# EAGLE board BMS_Master (EAGLE 6.6.0)
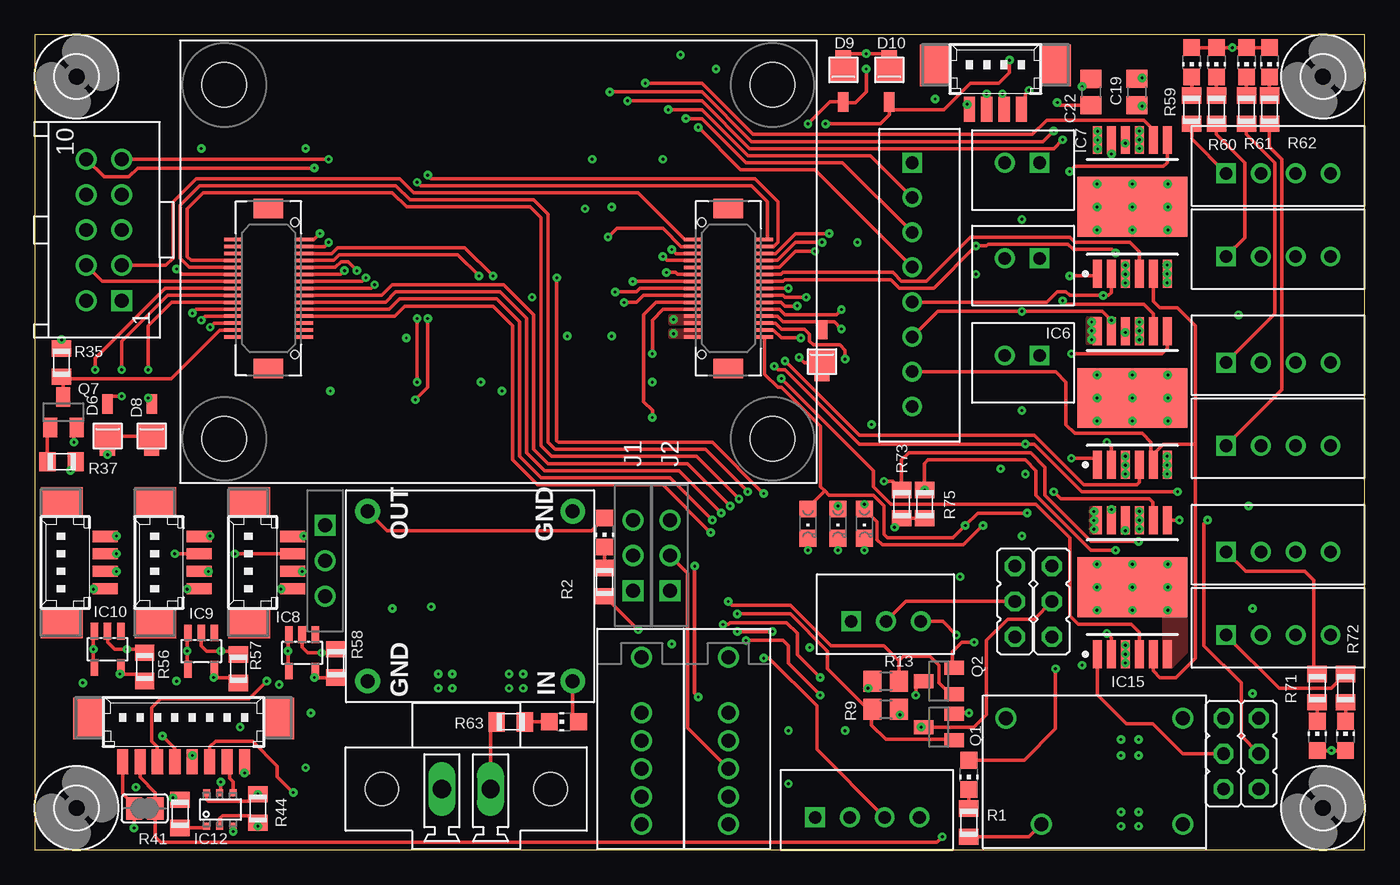
[diagram p7: board, top side]
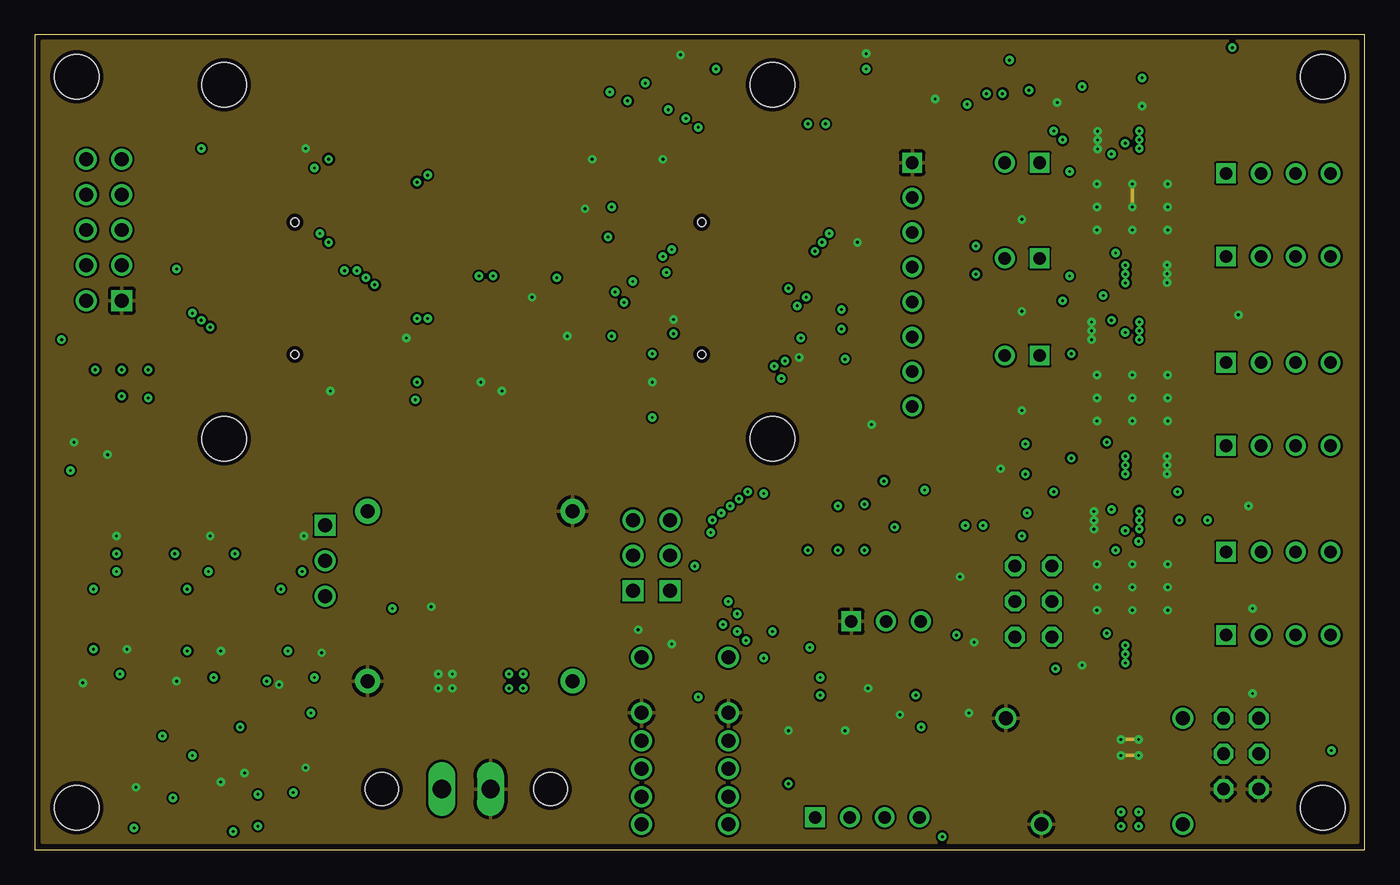
[diagram p8: board, inner layer Route2]
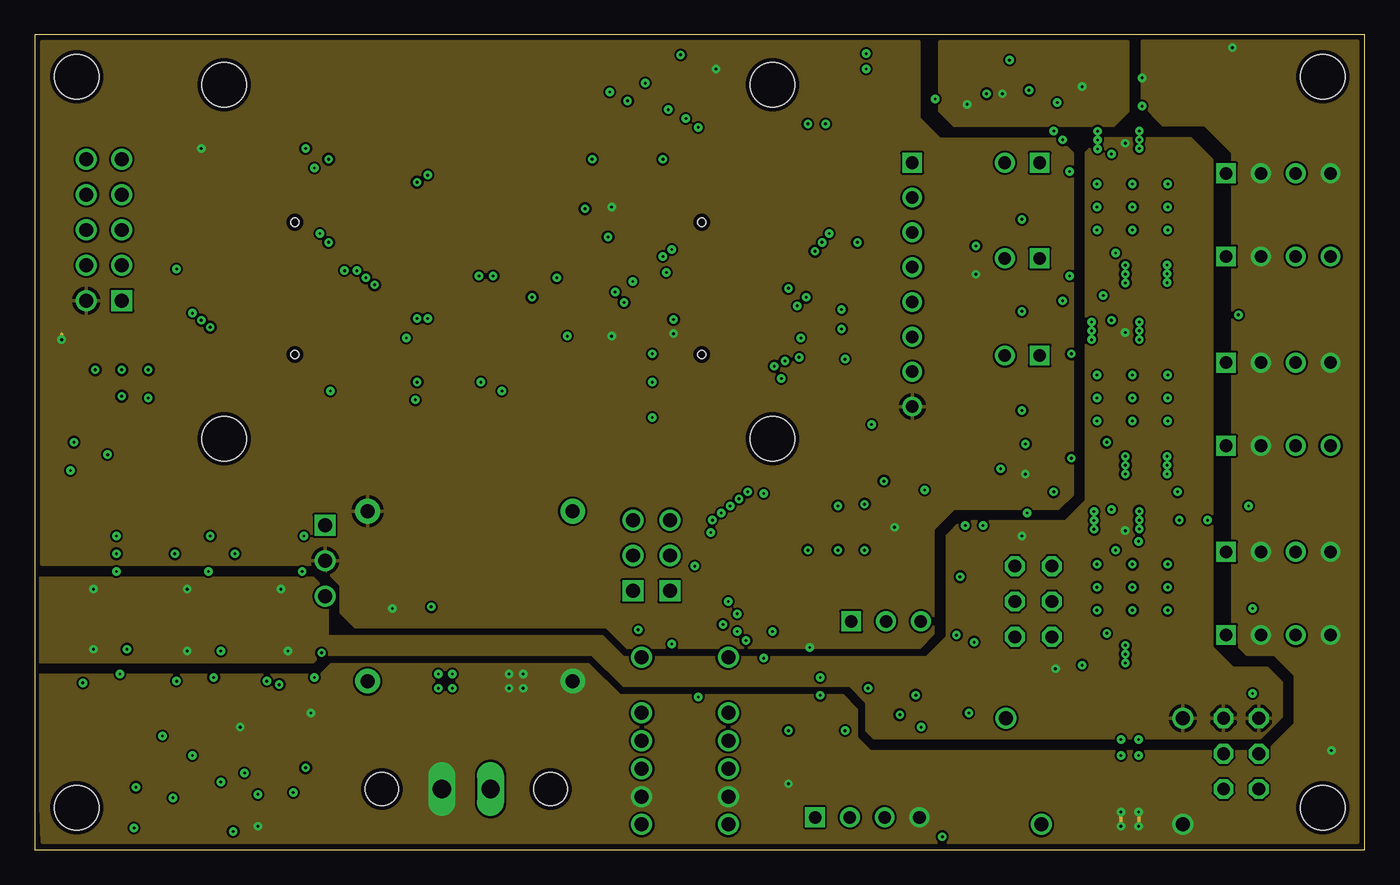
[diagram p9: board, inner layer Route15]
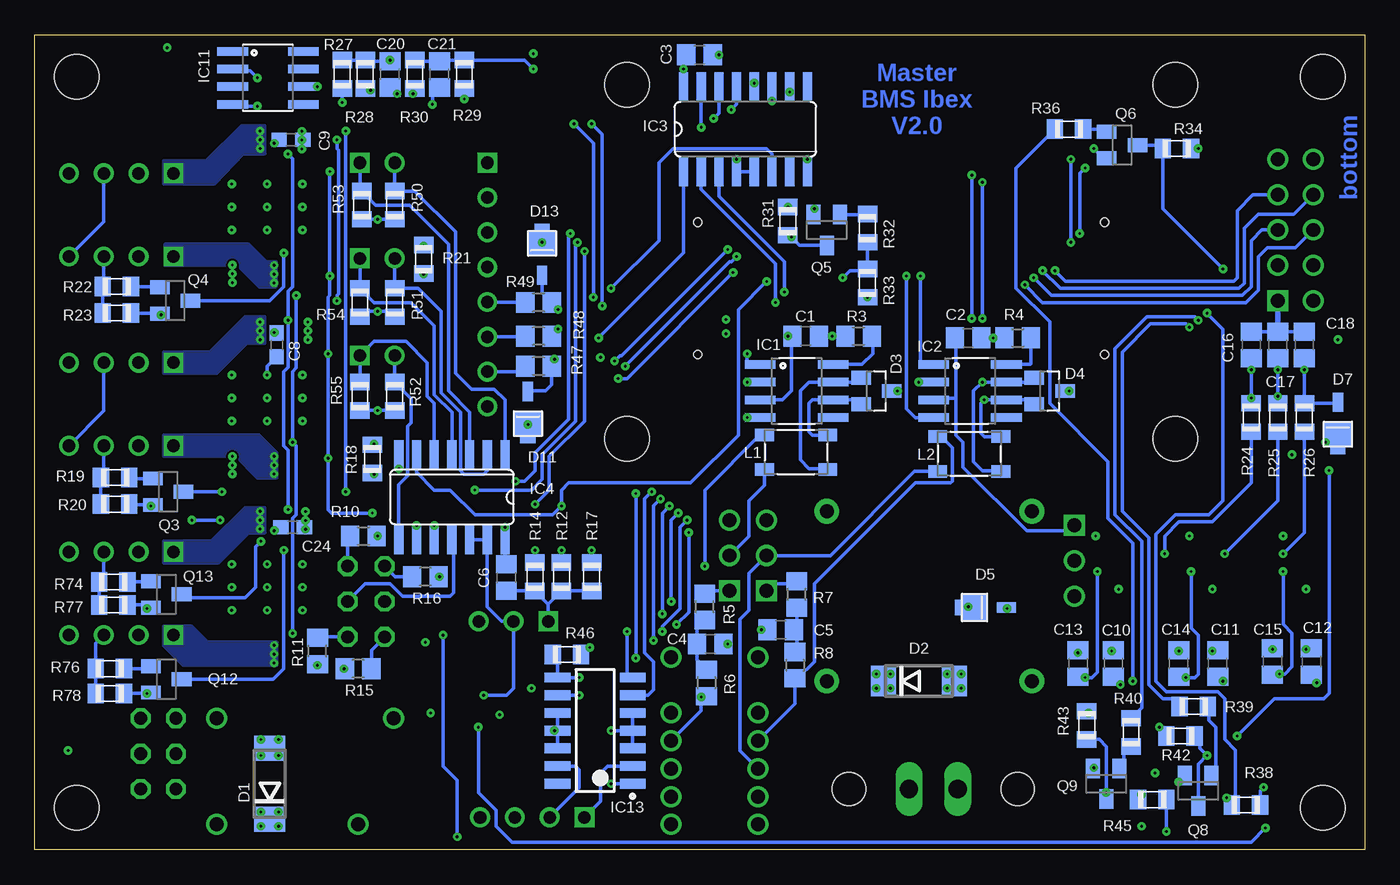
[diagram p10: board, bottom side, seen from below]

Size 95.5 x 58.5 mm. Coordinates in mm from the lower left corner, seen from the top.
Outline: 0,0 95.5,0 95.5,58.5 0,58.5 0,0
Copper layers (1+2*15+16): Top 0.035mm / dielectric 0.2mm / Route2 0.035mm / dielectric 0.5mm / Route15 0.035mm / dielectric 0.2mm / Bottom 0.035mm
Design rules "ats_35u_4layer *": minimum track width 6mil, minimum drill 0.2mm, track to track 6mil, track to pad 6mil, pad to pad 6mil, via to via 6mil, smd to smd 6mil, copper to edge 0.3mm, drill to drill 8mil, minimum pad ring 10mil, minimum via ring 0.2mm, stop-mask expansion 4mil, vias tented up to drill 0mil, thermal gap 10mil

## Footprints (pad centres in the part's own frame; a part is rotated, then mirrored left to right if it is on the bottom)
C0805 = smd 1.3 x 1.5: 1 -0.95,0; 2 0.95,0
C0603 = smd 1.1 x 1: 1 -0.85,0; 2 0.85,0
DO214AA = smd 1.8 x 2.2: A 2.55,0; C -2.55,0
SOT23 = smd 1 x 1.4: 1 -0.95,-1.1; 2 0.95,-1.1; 3 0,1.1
SM2T3V3A = smd 1.82 x 2.03: P$1 -1.21,0 | smd 1.38 x 0.75: P$2 1.1,0 | smd 0.5 x 1.1: P$11 -2.37,0.005
3,2 = hole 3.2: 0,0
SO08 = smd 0.61 x 2.21: 1 -1.905,-2.616; 2 -0.635,-2.616; 3 0.635,-2.616; 4 1.905,-2.616; 5 1.905,2.616; 6 0.635,2.616; 7 -0.635,2.616; 8 -1.905,2.616
SO16 = smd 0.66 x 2.032: 1 -4.445,-3.073; 2 -3.175,-3.073; 3 -1.905,-3.073; 4 -0.635,-3.073; 5 0.635,-3.073; 6 1.905,-3.073; 7 3.175,-3.073; 8 4.445,-3.073; 9 4.445,3.073; 10 3.175,3.073; 11 1.905,3.073; 12 0.635,3.073; 13 -0.635,3.073; 14 -1.905,3.073; 15 -3.175,3.073; 16 -4.445,3.073
SO14 = smd 0.66 x 2.032: 1 -3.81,-3.073; 2 -2.54,-3.073; 3 -1.27,-3.073; 4 0,-3.073; 5 1.27,-3.073; 6 2.54,-3.073; 7 3.81,-3.073; 8 3.81,3.073; 9 2.54,3.073; 10 1.27,3.073; 11 0,3.073; 12 -1.27,3.073; 13 -2.54,3.073; 14 -3.81,3.073
INF-PG-DSO-12-11_N_1PRIMARY = smd 2 x 0.65: 1 -4.8,2.5; 2 -4.8,1.5; 3 -4.8,0.5; 4 -4.8,-0.5; 5 -4.8,-1.5; 6 -4.8,-2.5; 7 4.8,-2.5; 8 4.8,-1.5; 9 4.8,-0.5; 10 4.8,0.5; 11 4.8,1.5; 12 4.8,2.5 | smd 4.3 x 7.9: 13 0,0
SOT23-5L = smd 0.55 x 1.2: 1 -0.95,-1.3; 2 0,-1.3; 3 0.95,-1.3; 4 0.95,1.3; 5 -0.95,1.3
SO08' = smd 0.61 x 2.21: 1 -1.905,-2.54; 2 -0.635,-2.54; 3 0.635,-2.54; 4 1.905,-2.54; 5 1.905,2.54; 6 0.635,2.54; 7 -0.635,2.54; 8 -1.905,2.54
TSOP-6 = smd 0.5 x 0.5: P$1 0.25,-0.25; P$2 0.25,-1.2; P$3 0.25,-2.15; P$4 2.65,-2.15; P$5 2.65,-1.2; P$6 2.65,-0.25
INF-PG-DSO-14-22_M_1PRIMARY = smd 1.85 x 0.7: 1 -2.7,3.81; 2 -2.7,2.54; 3 -2.7,1.27; 4 -2.7,0; 5 -2.7,-1.27; 6 -2.7,-2.54; 7 -2.7,-3.81; 8 2.7,-3.81; 9 2.7,-2.54; 10 2.7,-1.27; 11 2.7,0; 12 2.7,1.27; 13 2.7,2.54; 14 2.7,3.81
J_OR_S = drill 1: P$1 2.54,0; P$3 5.08,0 | drill 1 square: P$2 0,0
JP2_OCT = drill 0.914 octagon: 1 -2.54,0; 2 0,0; 3 2.54,0
ACT45B = smd 1.35 x 0.9: P$1 -0.675,0.45; P$2 3.875,0.45; P$3 -0.675,2.95; P$4 3.875,2.95
CHIP-LED0805 = smd 1.2 x 1.2: A 0,-1.05; C 0,1.05
CHIPLED_0805 = smd 1.2 x 1.2: A 0,-1.05; C 0,1.05
STM32F4_PROZESSORBOARD = smd 1.2 x 0.25: 1 3.75,10.47; 2 8.95,10.47; 3 3.75,10.97; 4 8.95,10.97; 5 3.75,11.47; 6 8.95,11.47; 7 3.75,11.97; 8 8.95,11.97; 9 3.75,12.47; 10 8.95,12.47; 11 3.75,12.97; 12 8.95,12.97; 13 3.75,13.47; 14 8.95,13.47; 15 3.75,13.97; 16 8.95,13.97; 17 3.75,14.47; 18 8.95,14.47; 19 3.75,14.97; 20 8.95,14.97; 21 3.75,15.47; 22 8.95,15.47; 23 3.75,15.97; 24 8.95,15.97; 25 3.75,16.47; 26 8.95,16.47; 27 3.75,16.97; 28 8.95,16.97; 29 3.75,17.47; 30 8.95,17.47; 31 41.97,17.47; 32 41.97,16.97; 33 41.97,16.47; 34 41.97,15.97; 35 41.97,15.47; 36 41.97,14.97; 37 41.97,14.47; 38 41.97,13.97; 39 41.97,13.47; 40 41.97,12.97; 41 41.97,12.47; 42 41.97,11.97; 43 41.97,10.97; 44 41.97,10.47; 45 36.77,10.47; 46 36.77,10.97; 47 36.77,11.47; 48 36.77,11.97; 49 36.77,12.47; 50 36.77,12.97; 51 36.77,13.47; 52 36.77,13.97; 53 36.77,14.47; 54 36.77,14.97; 55 36.77,15.47; 56 36.77,15.97; 57 36.77,16.47; 58 36.77,16.97; 59 36.77,17.47; 60 41.97,11.47 | smd 2.1 x 1.4: M1 6.35,8.22; M2 6.35,19.72; M3 39.37,8.22; M4 39.37,19.72 | hole 3.2: 3.175,3.175; 3.175,28.575; 42.545,28.575; 42.545,3.175 | hole 0.6: 8.25,9.22; 8.25,18.72; 37.47,18.72; 37.47,9.22
R0805 = smd 1.168 x 1.397: 1 -1.016,0; 2 1.016,0
R0805' = smd 1.3 x 1.5: 1 -0.95,0; 2 0.95,0
SJ = smd 1.168 x 1.6: 1 -0.762,0; 2 0.762,0
MAX16956_STEPDOWN6 = drill 1: GND 14.351,1.651; GND2 11.811,9.271; VIN 1.651,9.271; VOUT 1.651,1.651
MAX5035_STEPDOWN3 = drill 1 pad 1.778: GND@1 1.524,16.256; GND@2 13.716,1.524; VIN 1.524,1.524; VOUT 13.716,16.256
MCV1,5/2-GF-3,5 = drill 1.3 long: 1 0,3.5; 2 0,0 | hole 2.4: 0,7.8; 0,-4.3
90130-1110 = drill 1 square: 1 -5.08,-1.27 | drill 1: 2 -5.08,1.27; 3 -2.54,-1.27; 4 -2.54,1.27; 5 0,-1.27; 6 0,1.27; 7 2.54,-1.27; 8 2.54,1.27; 9 5.08,-1.27; 10 5.08,1.27
CIOC_4-1-FV = drill 1: 1 0,0; 2 2,0; 3 4,0; 4 6,0; 5 -4,0; 6 8,0
B8B-XH = drill 0.9 pad 1.422 square: P$1 0,0 | drill 0.9 pad 1.422: P$2 2.5,0; P$3 5,0; P$4 7.5,0; P$5 10,0; P$6 12.5,0; P$7 15,0; P$8 17.5,0
B2B-XH = drill 0.9 pad 1.422 square: P$1 0,0 | drill 0.9 pad 1.422: P$2 2.5,0
B4B-XH = drill 0.9 pad 1.422 square: P$1 0,0 | drill 0.9 pad 1.422: P$2 2.5,0; P$3 5,0; P$4 7.5,0
53398-04 = smd 0.8 x 1.8: 1 1.875,-2.5; 2 0.625,-2.5; 3 -0.625,-2.5; 4 -1.875,-2.5 | smd 2.1 x 3: S1 4.375,0.625; S2 -4.375,0.625
53398-08 = smd 0.8 x 1.8: 1 4.375,-2.5; 2 3.125,-2.5; 3 1.875,-2.5; 4 0.625,-2.5; 5 -0.625,-2.5; 6 -1.875,-2.5; 7 -3.125,-2.5; 8 -4.375,-2.5 | smd 2.1 x 3: S1 6.875,0.625; S2 -6.875,0.625
B3B-XH = drill 0.9 pad 1.422 square: P$1 0,0 | drill 0.9 pad 1.422: P$2 2.5,0; P$3 5,0

## Placement (x,y rotation side)
C1  100n  [C0805]  40.15,36.87 0 bottom
C2  100n  [C0805]  28.47,36.74 0 bottom
C3  100n  [C0805]  47.77,57.06 0 bottom
C4  47n  [C0805]  47.01,14.77 0 bottom
C5  47n  [C0805]  41.93,15.79 180 bottom
C6  100n  [C0805]  61.64,19.53 270 bottom
C8  100n  [C0603]  78.12,36.24 270 bottom
C9  100n  [C0603]  77.11,50.97 0 bottom
C10  100n  [C0805]  18.05,13.38 270 bottom
C11  100n  [C0805]  10.56,13.38 270 bottom
C12  100n  [C0805]  3.83,13.5 270 bottom
C13  100n  [C0805]  20.59,13.38 90 bottom
C14  100n  [C0805]  13.35,13.38 90 bottom
C15  100n  [C0805]  6.62,13.5 90 bottom
C16  100n  [C0805]  8.15,36.24 90 bottom
C17  100n  [C0805]  6.24,36.24 90 bottom
C18  100n  [C0805]  4.34,36.24 90 bottom
C19  1uF  [C0805]  79.14,54.4 270 top
C20  ?  [C0805]  70,55.67 90 bottom
C21  ?  [C0805]  66.44,55.67 90 bottom
C22  2,2uF  [C0805]  75.84,54.39 270 top
C24  100n  [C0603]  76.98,23.16 0 bottom
D1  18V  [DO214AA]  78.63,4.74 90 bottom
D2  18V  [DO214AA]  32.02,12.11 0 bottom
D3  NUP2105LT1G|SOT23  [SOT23]  35.07,32.93 270 bottom
D4  NUP2105LT1G|SOT23  [SOT23]  22.62,32.93 270 bottom
D5  SM2T3V3A  [SM2T3V3A]  26.82,17.39 0 bottom
D6  SM2T3V3A  [SM2T3V3A]  5.22,30.9 90 top
D7  SM2T3V3A  [SM2T3V3A]  1.92,31.03 90 bottom
D8  SM2T3V3A  [SM2T3V3A]  8.4,30.9 90 top
D9  SM2T3V3A  [SM2T3V3A]  58.06,54.78 270 top
D10  SM2T3V3A  [SM2T3V3A]  61.36,54.78 270 top
D11  SM2T3V3A  [SM2T3V3A]  60.09,31.79 90 bottom
D12  SM2T3V3A  [SM2T3V3A]  56.53,36.24 90 top
D13  SM2T3V3A  [SM2T3V3A]  59.07,42.33 270 bottom
H1  MOUNT-HOLE3.2  [3,2]  92.5,3 0 top
H2  MOUNT-HOLE3.2  [3,2]  3,3 0 top
H3  MOUNT-HOLE3.2  [3,2]  92.5,55.5 0 top
H4  MOUNT-HOLE3.2  [3,2]  3,55.5 0 top
IC1  SN65HVD230D  [SO08]  40.79,32.93 270 bottom
IC2  SN65HVD230D  [SO08]  28.34,32.93 270 bottom
IC3  74HC138D  [SO16]  44.47,51.73 0 bottom
IC4  4073D  [SO14]  65.55,25.31 180 bottom
IC6  TLE8102SGN  [INF-PG-DSO-12-11_N_1PRIMARY]  78.81,32.43 90 top
IC7  TLE8102SGN  [INF-PG-DSO-12-11_N_1PRIMARY]  78.81,46.15 90 top
IC8  1,8V  [SOT23-5L]  19.2,14.14 180 top
IC9  1,8V  [SOT23-5L]  11.96,14.27 180 top
IC10  1,8V  [SOT23-5L]  5.22,14.39 180 top
IC11  5V  [SO08']  78.76,55.41 270 bottom
IC12  BSL308C  [TSOP-6]  12.08,1.44 90 top
IC13  TLE4207GM  [INF-PG-DSO-14-22_M_1PRIMARY]  55.26,8.55 180 bottom
IC15  TLE8102SGN  [INF-PG-DSO-12-11_N_1PRIMARY]  78.81,18.84 90 top
J1  JUMPER_SWITCHS  [J_OR_S]  42.94,18.58 90 top
J2  JUMPER_SWITCHS  [J_OR_S]  45.61,18.58 90 top
J3  JUMPER_SWITCHS  [J_OR_S]  20.85,23.28 270 top
JP1  [JP2_OCT]  87.9,6.9 270 top
JP2  [JP2_OCT]  85.36,6.9 270 top
JP3  [JP2_OCT]  70.38,17.82 90 top
JP4  [JP2_OCT]  73.04,17.82 270 top
L1  ACT45B-510-2P-TL003  [ACT45B]  42.44,26.84 0 bottom
L2  ACT45B-510-2P-TL003  [ACT45B]  29.99,26.71 0 bottom
LED1  green  [CHIP-LED0805]  67.07,5.38 180 top
LED2  green  [CHIP-LED0805]  40.91,22.77 180 top
LED3  green  [CHIPLED_0805]  57.68,23.41 180 top
LED4  green  [CHIPLED_0805]  59.58,23.41 180 top
LED5  green  [CHIPLED_0805]  55.52,23.41 180 top
LED6  green  [CHIP-LED0805]  83.08,56.53 180 top
LED7  green  [CHIP-LED0805]  84.85,56.53 180 top
LED8  green  [CHIP-LED0805]  87.01,56.53 180 top
LED9  green  [CHIP-LED0805]  88.66,56.53 180 top
LED10  green  [CHIP-LED0805]  37.99,9.19 90 top
LED12  green  [CHIP-LED0805]  92.09,8.17 0 top
LED13  green  [CHIP-LED0805]  94.12,8.17 0 top
PROZ1  STM32F4_PROZESSORBOARDRPZ  [STM32F4_PROZESSORBOARD]  10.43,26.33 0 top
Q1  BSS205N  [SOT23]  64.92,8.8 90 top
Q2  BSS205N  [SOT23]  64.92,12.11 90 top
Q3  BSS205N  [SOT23]  85.93,25.7 270 bottom
Q4  BSS205N  [SOT23]  85.42,39.41 270 bottom
Q5  BSS205N  [SOT23]  38.63,44.49 180 bottom
Q6  BSS205N  [SOT23]  17.42,50.59 270 bottom
Q7  BSS205N  [SOT23]  2.05,31.41 0 top
Q8  BSS205N  [SOT23]  11.96,4.23 180 bottom
Q9  BSS205N  [SOT23]  18.56,4.74 180 bottom
Q12  BSS205N  [SOT23]  86.05,12.24 270 bottom
Q13  BSS205N  [SOT23]  86.05,18.33 270 bottom
R1  620R  [R0805]  67.07,1.95 90 top
R2  240R  [R0805]  40.91,19.22 90 top
R3  50k  [R0805']  36.34,36.87 0 bottom
R4  50k  [R0805']  24.91,36.74 0 bottom
R5  60R  [R0805']  47.39,17.44 90 bottom
R6  60R  [R0805']  47.26,11.98 270 bottom
R7  60R  [R0805']  40.79,18.33 90 bottom
R8  60R  [R0805']  40.91,13.25 270 bottom
R9  10k  [R0805']  61.11,10.07 180 top
R10  1k  [R0805']  71.9,22.52 0 bottom
R11  10k  [R0805']  75.2,14.27 90 bottom
R12  240R  [R0805]  57.68,19.6 90 bottom
R13  10k  [R0805']  61.11,12.11 0 top
R14  240R  [R0805]  59.58,19.6 90 bottom
R15  1k  [R0805']  72.28,13 180 bottom
R16  10k  [R0805']  67.45,19.6 180 bottom
R17  240R  [R0805]  55.52,19.6 90 bottom
R18  1K  [R0805]  71.27,28.05 270 bottom
R19  1K  [R0805]  89.74,26.71 180 bottom
R20  10K  [R0805]  89.74,24.81 180 bottom
R21  1K  [R0805]  67.58,42.39 270 bottom
R22  1K  [R0805]  89.61,40.43 180 bottom
R23  10K  [R0805]  89.61,38.53 180 bottom
R24  1K  [R0805]  8.15,31.03 90 bottom
R25  1K  [R0805]  6.24,31.03 90 bottom
R26  1K  [R0805]  4.34,31.03 90 bottom
R27  ?  [R0805]  73.42,55.67 270 bottom
R28  ?  [R0805]  71.77,55.67 90 bottom
R29  ?  [R0805]  64.66,55.67 270 bottom
R30  ?  [R0805]  68.22,55.67 90 bottom
R31  1K  [R0805]  41.42,45.13 90 bottom
R32  1K  [R0805]  35.7,44.62 270 bottom
R33  10K  [R0805]  35.7,40.68 90 bottom
R34  1K  [R0805]  13.48,50.33 0 bottom
R35  1K  [R0805]  1.92,34.97 90 top
R36  1K  [R0805]  21.23,51.73 180 bottom
R37  1K  [R0805]  1.92,27.85 0 top
R38  10K  [R0805]  8.53,3.22 0 bottom
R39  1K  [R0805]  12.27,10.28 180 bottom
R40  1K  [R0805]  16.78,8.42 90 bottom
R41  1K  [R0805]  10.43,2.58 90 top
R42  1K  [R0805]  13.23,8.17 180 bottom
R43  1K  [R0805]  19.96,8.93 90 bottom
R44  10K  [R0805]  16.02,2.96 270 top
R45  1K  [R0805]  15.26,3.6 180 bottom
R46  10K  [R0805]  57.3,14.01 0 bottom
R47  100R  [R0805']  59.33,34.71 180 bottom
R48  100R  [R0805']  59.33,36.87 180 bottom
R49  100R  [R0805']  59.33,39.28 180 bottom
R50  10K  [R0805]  69.65,46.27 90 bottom
R51  10K  [R0805]  69.65,39.28 90 bottom
R52  10K  [R0805]  69.65,32.55 90 bottom
R53  10K  [R0805]  72.03,46.27 90 bottom
R54  10K  [R0805]  72.15,39.28 90 bottom
R55  10K  [R0805]  72.15,32.55 90 bottom
R56  330R  [R0805]  7.89,13.12 90 top
R57  330R  [R0805]  14.62,13 90 top
R58  330R  [R0805]  21.61,13.38 90 top
R59  560R  [R0805]  83.08,53.13 90 top
R60  560R  [R0805]  84.85,53.13 90 top
R61  560R  [R0805]  87.01,53.13 90 top
R62  560R  [R0805]  88.66,53.13 90 top
R63  560R  [R0805]  34.18,9.19 0 top
R71  560R  [R0805]  92.09,11.6 270 top
R72  560R  [R0805]  94.12,11.6 270 top
R73  1K  [R0805]  62.25,24.81 270 top
R74  1K  [R0805]  89.86,19.22 180 bottom
R75  1K  [R0805]  63.9,24.81 270 top
R76  1K  [R0805]  90.12,13 180 bottom
R77  10K  [R0805]  89.86,17.57 180 bottom
R78  10K  [R0805]  90.12,11.22 180 bottom
SJ1  [SJ]  7.89,2.96 180 top
TB1  MAX16956_STEPDOWN6  [MAX16956_STEPDOWN6]  84.09,11.09 180 top
TERA-DC/DC1  [MAX5035_STEPDOWN3]  40.15,10.58 90 top
X1  MCV1,5/2-GF-3,5  [MCV1,5/2-GF-3,5]  29.23,4.36 270 top
X2  TERA-PROG-DEBUG-10GERADE  [90130-1110]  4.97,44.49 90 top
X3  CIOC_4-1-FV-A_CAN-BELEGUNG  [CIOC_4-1-FV]  43.58,9.82 270 top
X4  CIOC_4-1-FV-A_CAN-BELEGUNG  [CIOC_4-1-FV]  49.8,9.82 270 top
X5  B8B-XH  [B8B-XH]  63.01,49.32 270 top
X6  B2B-XH  [B2B-XH]  72.15,49.32 180 top
X7  B2B-XH  [B2B-XH]  72.15,42.46 180 top
X8  B2B-XH  [B2B-XH]  72.15,35.47 180 top
X9  B4B-XH  [B4B-XH]  85.55,29 0 top
X10  B4B-XH  [B4B-XH]  85.55,34.97 0 top
X11  B4B-XH  [B4B-XH]  85.55,42.59 0 top
X12  B4B-XH  [B4B-XH]  85.55,48.56 0 top
X13  53398-04  [53398-04]  16.02,20.62 90 top
X14  53398-04  [53398-04]  9.29,20.62 90 top
X15  53398-04  [53398-04]  2.56,20.62 90 top
X16  53398-04  [53398-04]  68.98,55.67 0 top
X17  B4B-XH  [B4B-XH]  56.02,2.33 0 top
X18  53398-08  [53398-08]  10.69,8.8 0 top
X20  B3B-XH  [B3B-XH]  58.63,16.39 0 top
X21  B4B-XH  [B4B-XH]  85.55,21.38 0 top
X22  B4B-XH  [B4B-XH]  85.55,15.41 0 top

## Tracks (layer width: path | path; a pad name or v marks a point on that pad's centre or on a via)
+3V3  (via drill 0.2)
  Top 0.254: R35.2 v1.92,36.62 | R75.2 R73.2 61.74,23.66 v61.74,23.16 | TERA-DC/DC1.VOUT 25.29,22.9 39.99,22.9 LED2.A
  Route15 0.254: v1.92,36.62 1.92,37
  Bottom 0.254: 25.68,17.39 D5.P$2 25.67,17.34 v25.67,17.31 | IC1.3 41.8,32.3 41.17,32.93 41.17,36.8 C1.1 v41.42,36.87 | IC3.16 v48.91,56.05 48.91,56.87 C3.1 | R34.2 v11.96,50.33 | v61.74,23.16 IC4.14 61.74,20.58 C6.1 | R18.2 71.21,27.04 v71.14,26.96 | R21.2 v67.58,41.32 | v55.64,14.52 56.15,14.01 R46.2
  other vias: 45.87,37.05 41.42,46.14
  pour Route15: 0.5,20.5 20.5,20.5 22,19 22,17 23,16 41.06,16 42.52,14.54 63.51,14.49 64.5,15.49 64.5,23 66,24.5 73.5,24.5 74.5,25.5 74.5,50 73.5,51 65,51 63.5,52.5 63.5,58 0.5,58
  pour Top (no thermals): 47.82,36.79 45.61,36.79 45.61,37.3 47.82,37.3
+5V  (via drill 0.2)
  Top 0.254: IC6.10 78.31,37.22 v78.31,37.13 | IC10.4 4.21,13.16 v4.21,14.39 4.21,15.63 IC10.3 | IC9.4 10.94,13.03 v10.94,14.27 10.94,15.5 IC9.3 | IC8.3 18.18,15.37 v18.18,14.27 18.18,12.9 IC8.4 | X13.4 17.83,18.74 17.8,18.71 v17.67,18.71 | X14.4 11.22,18.74 11.19,18.71 v10.94,18.71 | X15.4 4.37,18.74 4.34,18.71 v4.21,18.71 | v78.31,50.72 78.31,50.94 IC7.10 | v78.31,22.91 78.31,23.63 IC15.10 | LED1.A 71.05,6.43 73.3,8.68 v73.3,13
  Bottom 0.254: 4.02,14.45 C12.1 3.89,14.39 v4.21,14.39 | C11.1 10.88,14.33 v10.94,14.27 | v78.31,37.13 78.31,37.03 C8.1 | C9.1 78.05,50.72 v78.31,50.72 | v18.18,14.27 18.11,14.27 C10.1 | C24.1 v78.31,22.91
  Bottom 0.406: v73.3,13 R15.2 | R10.2 v70.88,22.52
  pour Route15: 20,13.5 0,13.5 0,19.5 20,19.5 21,18.5 21,14.5
  pour Route15: 76.52,51.04 83.02,51.04 84.52,49.54 84.52,14.54 86.02,13.04 88.52,13.04 89.52,12.04 89.52,9.54 88.02,8.04 60.27,8.04 59.77,8.54 59.77,10.54 58.52,11.79 42.27,11.79 40.02,14.04 20.27,14.04 20.27,15.29 40.77,15.29 42.27,13.79 64.02,13.79 65.52,15.29 65.52,22.54 66.52,23.54 74.02,23.54 75.52,25.04 75.52,50.04
CAN1_H
  Bottom 0.254: X3.3 44.85,7.09 44.85,16.55 44.21,17.19 44.21,19.85 J1.P$1 38.37,21.12 32.33,27.16 L2.P$1
CAN1_L
  Bottom 0.254: L2.P$3 30.38,29.38 30.12,29.38 29.61,28.87 29.61,26.46 29.74,26.33 32.28,26.33 39.52,19.09 39.52,13.5 40.72,12.3 R8.2 40.91,10.49 X3.2
CAN1_RXD  (via drill 0.2)
  Top 0.254: v32.91,41.19 30.88,43.22 21.73,43.22 21.31,42.8 PROZ1.26
  Bottom 0.254: IC2.4 32.28,31.03 32.91,31.66 v32.91,41.19
CAN1_TXD  (via drill 0.2)
  Top 0.254: v31.89,41.19 30.37,42.71 21.86,42.71 21.45,42.3 PROZ1.24
  Bottom 0.254: v31.89,41.19 31.89,34.79 31.01,34.79 IC2.1
CAN2_H
  Top 0.254: J2.P$1 46.88,19.85 46.88,8.74 X4.3
  Bottom 0.254: L1.P$1 43.11,26.16 44.21,25.06 44.21,22.52 J2.P$1
CAN2_H0
  Bottom 0.254: D3.1 36.48,33.57 IC1.7 39.9,33.57 40.53,32.93 40.53,27.98 39.9,27.35 38.62,27.35 L1.P$2
CAN2_L  (via drill 0.2)
  Top 0.254: v47.64,10.96 47.39,11.22 v47.39,20.36
  Bottom 0.254: L1.P$3 43.42,29.79 47.39,25.82 v47.39,20.36 | R6.2 47.33,10.96 v47.64,10.96 47.64,9.98 X4.2
CAN2_L0
  Bottom 0.254: D3.2 36.48,32.3 IC1.6 39.64,32.3 39.9,32.04 39.9,30.01 39.64,29.76 38.59,29.76 L1.P$4
CAN2_RXD  (via drill 0.2)
  Top 0.254: PROZ1.50 44.61,39.3 43.71,38.39 43.71,32.17 44.34,31.54 v44.34,31.03
  Bottom 0.254: v44.34,31.03 IC1.4
CAN2_TXD  (via drill 0.2)
  Top 0.254: PROZ1.49 45.13,38.8 44.34,38.01 v44.34,35.6
  Bottom 0.254: v44.34,35.6 44.34,34.84 IC1.1
CANP_H  (via drill 0.2)
  Top 0.254: PROZ1.31 52.6,43.8 52.6,46.52 51.45,47.67 27.7,47.67 v27.45,47.92 | v27.45,38.14 v27.45,33.57
  Bottom 0.254: L2.P$2 26.17,27.22 27.45,27.22 28.09,27.85 28.09,32.93 v27.45,33.57 IC2.7 24.04,33.57 D4.1 | v27.45,47.92 v27.45,38.14
CANP_L  (via drill 0.2)
  Top 0.254: PROZ1.32 53.06,43.3 53.36,43.6 53.36,46.52 51.71,48.17 28.47,48.17 v28.21,48.43 | v28.21,38.14 28.21,33.19 v27.32,32.3
  Bottom 0.254: L2.P$4 26.14,29.63 27.32,29.63 27.58,29.89 27.58,32.04 v27.32,32.3 IC2.6 24.04,32.3 D4.2 | v28.21,48.43 v28.21,38.14
CH_DI3_EX  (via drill 0.2)
  Top 0.254: X18.3 12.56,7.38 12.97,7.79 15.64,7.79 17.42,6.01 17.42,5.25 v18.56,4.11
  Bottom 0.254: Q9.3 v18.56,4.11 18.56,7.41 19.07,7.92 R43.1
CH_DI4_EX  (via drill 0.2)
  Top 0.254: v11.32,6.77 v11.31,6.76 X18.4
  Bottom 0.254: R42.1 11.83,7.79 11.83,7.28 v11.32,6.77 11.96,6.14 Q8.3
CH_DO2_EX  (via drill 0.2)
  Top 0.254: X18.6 8.78,6.33 8.78,7.41 8.4,7.79 8.4,10.2 9.04,10.84 15.39,10.84 v16.66,12.11
  Bottom 0.254: v16.66,12.11 16.66,22.01 18.43,23.79 18.43,27.85 22.62,32.04 22.62,37.89 25.04,40.3 25.04,48.94 R36.2
CH_FLT_EX  (via drill 0.2)
  Top 0.254: v9.16,8.17 10.06,7.27 X18.5 | v2.56,27.22 2.56,27.47 R37.2
  Bottom 0.254: v2.56,27.22 2.56,11.22 2.94,10.84 6.5,10.84 v9.16,8.17
CH_NDI3  (via drill 0.2)
  Top 0.254: v11.96,38.01 12.24,38.3 PROZ1.7
  Bottom 0.254: R40.2 16.02,10.2 16.02,22.14 17.93,24.04 17.93,35.98 15.64,38.27 12.21,38.27 v11.96,38.01
CH_NDI4  (via drill 0.2)
  Top 0.254: v12.59,37.51 12.89,37.8 PROZ1.5
  Bottom 0.254: R39.2 13.29,10.39 13.73,10.84 14.5,10.84 15.51,11.85 15.51,22.39 17.42,24.3 17.42,35.73 15.39,37.76 12.85,37.76 v12.59,37.51
CH_NDO2  (via drill 0.2)
  Top 0.254: PROZ1.19 10.58,41.3 v10.18,41.7
  Bottom 0.254: 14.88,50.84 14.5,50.46 R34.1 | v10.18,41.7 14.5,46.01 R34.1 | Q6.3 14.5,50.59 R34.1
CH_NFLT
  Top 0.254: 2.05,33.82 9.8,33.82 13.27,37.3 PROZ1.3 | Q7.3 2.05,33.82 | 2.05,33.82 R35.1
CH_PON  (via drill 0.2)
  Top 0.254: v11.32,38.52 11.6,38.8 PROZ1.9 | v9.92,3.72 10.31,3.72 R41.2
  Bottom 0.254: 9.29,3.72 9.29,7.15 10.05,7.92 10.05,10.84 10.56,11.34 14.24,11.34 15,12.11 15,22.65 13.61,24.04 11.19,24.04 10.18,25.06 10.18,37.38 v11.32,38.52 | 9.16,3.09 9.29,3.09 9.29,3.22 | 9.29,3.22 9.29,3.72 | 9.29,3.72 v9.92,3.72 | R38.1 9.29,3.22
CH_PON_EX
  Top 0.254: IC12.P$4 14.23,4.88 13.99,5.12 13.99,6.13 X18.2
CS_B0  (via drill 0.2)
  Top 0.254: v55.01,36.74 53.61,36.74 53.06,37.3 PROZ1.43
  Bottom 0.254: 49.04,49.57 48.91,49.44 IC3.1 48.91,42.84 v55.01,36.74
CS_B1  (via drill 0.2)
  Top 0.254: v42.31,39.28 v42.32,39.29 43.21,39.29 43.71,39.8 PROZ1.51
  Bottom 0.254: IC3.2 47.64,47.41 42.31,42.08 v42.31,39.28
CS_B2  (via drill 0.2)
  Top 0.254: v41.67,40.05 43.2,40.05 43.45,40.3 PROZ1.52
  Bottom 0.254: IC3.3 46.37,46.9 41.67,42.2 v41.67,40.05
GND  (via drill 0.2)
  Top 0.254: IC7.13 77.04,46.15 76.31,46.87 | X15.1 4.75,22.49 4.72,22.52 v5.86,22.52 | X14.1 11.61,22.49 11.58,22.52 v12.59,22.52 | X13.1 18.08,22.49 18.05,22.52 v19.32,22.52 | IC8.2 19.2,14.52 19.58,14.14 v20.59,14.14 21.35,14.14 R58.2 | IC9.2 11.96,14.65 12.34,14.27 v13.35,14.27 14.37,14.27 R57.2 | IC10.2 5.22,14.9 5.73,14.39 v6.62,14.39 7.64,14.39 R56.2 | v2.81,29.25 2.81,29.87 3,30.06 Q7.2 | X18.1 v15.06,5.5 | 76.27,50.91 v76.31,50.95 | v67.45,14.9 66.57,14.9 65.89,14.22 65.89,13.18 Q2.2 | v62.12,9.69 62.12,10.01 R9.1 | 60.16,11.79 R13.1 59.84,11.79 v59.84,11.6 | D6.P$11 | D6.P$11 D6.P$1 | D6.P$1 4.99,29.93 | D6.P$11 v5.22,28.36 | D6.P$1 D8.P$1 D8.P$11 | D10.P$1 D10.P$11 v59.71,57.15 D9.P$11 D9.P$1 | v13.35,4.87 13.35,4.16 IC12.P$5 | Q1.2 66.5,9.75 66.57,9.82 v67.07,9.82 | C19.2 79.2,53.07 v79.52,53.38 | IC6.12 76.31,37.17 76.15,37 | D12.P$11 D12.P$1 56.47,34.97 55.26,34.97 v54.88,35.35 | IC15.6 81.31,13.25 81.35,13.25 | R1.1 71.39,0.93 TB1.GND2 | v81.31,27.6 IC6.6 | C22.2 73.62,53.44 v73.42,53.63 | R2.1 v43.33,15.79 | R63.1 32.73,8.75 X1.1
  Route2 0.254: v78,6.77 v79.27,6.77 | v79.27,7.92 v78,7.92 | v78.81,47.8 IC7.13 | 59.71,57.19 v59.71,57.15
  Bottom 0.254: v29.99,12.61 29.47,12.61 D2.A | D5.P$11 28.51,17.4 v28.47,17.44 28.42,17.39 D5.P$1 | D3.3 v33.55,32.93 | IC1.2 v44.34,33.57 | R3.1 v38.24,36.87 C1.2 | R4.1 v26.69,36.74 C2.2 | 21.27,32.89 v21.23,32.93 D4.3 | IC2.2 v32.02,33.57 | D1.A 78.11,6.77 v78,6.77 | v79.27,6.77 v79.27,7.92 | IC3.5 IC3.4 v45.1,49.57 | v6.62,14.39 6.56,14.39 C15.2 | v13.35,14.27 13.29,14.27 C14.2 | v20.59,14.14 20.4,14.14 C13.2 | C16.2 C17.2 C18.2 4.27,37.12 3.7,37.12 | 39.92,48.66 IC3.8 v40.02,49.57 | C3.2 v46.37,57.06 | 12.59,5.12 12.59,5.14 12.85,5.14 | 12.85,5.14 13.08,5.14 v13.35,4.87 | R27.2 v73.42,53.63 | R29.2 v64.66,53.89 | R38.2 7.51,4.23 v7.26,4.49 | IC13.11 v58.18,8.55 | IC13.4 v54.12,8.55 | IC13.4 IC13.5 | IC13.3 IC13.4 | IC13.12 IC13.11 | IC13.11 IC13.10 | R16.1 v66.44,19.6 | D7.P$11 D7.P$1 2.49,29.25 v2.81,29.25 | v79.52,53.38 81.17,53.38 IC11.4 | C5.2 v43.33,15.79 | C4.2 v45.74,14.77 | Q6.2 18.75,49.64 v19.45,50.33 | Q8.2 12.78,5.21 12.85,5.14 | Q5.2 39.52,45.65 v39.52,46.01 | v17.54,11.85 17.54,11.92 C10.2 | v10.18,12.11 10.24,12.11 C11.2 | v3.45,11.98 3.45,12.17 C12.2 | v69.36,27.35 IC4.7 | v19.45,5.88 19.47,5.88 Q9.2 | R55.1 v70.88,31.54 R52.1 | R53.1 v70.88,45.25 R50.1 | D11.P$11 v60.09,30.52 D11.P$1 | D13.P$11 v59.07,43.6 D13.P$1 | R51.1 69.65,38.65 v70.88,38.65 72.15,38.65 R54.1 | R78.1 v87.45,11.22 87.22,11.22 Q12.2 | Q13.2 87.38,17.38 v87.45,17.32 87.7,17.57 R77.1 | R23.1 86.58,38.53 Q4.2 86.5,38.46 v86.43,38.4 | R11.1 v75.2,13.25 | C9.2 76.16,50.85 v76.31,50.95 | C8.2 78.81,34.7 v78.81,34.08 | C24.2 76.13,23.08 v76.06,23.01 | R20.1 88.66,24.75 Q3.2 87.09,24.68 v87.16,24.68 | C6.2 R14.1 58.63,17.63 X20.P$1 58.63,17.63 R12.1 R17.1
  Bottom 0.406: C17.2 X2.1
  other vias: 45.87,38.06 29.99,11.6 28.97,11.6 28.97,12.61 76.27,44.49 78.81,44.49 81.35,44.49 81.35,46.15 81.35,47.8 78.81,46.15 76.27,47.8 76.27,46.15 78.81,30.78 78.81,32.43 81.35,30.78 81.35,32.43 81.35,34.08 76.27,30.78 76.27,32.43 76.27,34.08 35.7,39.66 76.27,17.19 81.35,17.19 81.35,18.84 81.35,20.49 78.81,20.49 76.27,18.84 78.81,17.19 78.81,18.84 76.27,20.49 81.31,26.97 81.31,28.24 75.89,36.62 75.89,37.26 75.89,37.89 81.31,41.35 81.31,41.98 81.31,40.71 76.06,23.64 76.06,24.28 76.31,51.58 76.31,50.31
  pour Top (no thermals): 47.82,37.76 45.61,37.76 45.61,38.32 47.82,38.32
  pour Route2: 0.52,0.54 0.52,58.04 95.02,58.04 95.02,0.54
  pour Top (no thermals): 82.62,17.57 82.62,14.14 81.61,13.13 81.1,13.13 81.1,17.57
  pour Top (no thermals): 76.47,38.14 75.58,38.14 75.58,36.36 76.47,36.36
  pour Top (no thermals): 76.47,24.55 75.84,24.55 75.84,22.77 76.47,22.77
HS_CO1
  Top 0.254: PROZ1.36 53.6,41.3 53.74,41.44 61.61,41.44 62.25,40.81 64.03,40.81 67.2,43.98 74.31,43.98 74.69,43.6 78.63,43.6 79.31,42.92 IC7.4
HS_RM  (via drill 0.2)
  Top 0.254: PROZ1.37 53.73,40.8 53.87,40.93 61.49,40.93 62.1,40.32 64.56,40.32 v67.58,43.35 68.34,43.35 68.47,43.47 74.19,43.47 74.57,43.09 77.36,43.09 v77.61,42.84
  Bottom 0.254: R21.1 67.51,43.4 v67.58,43.35 | v77.61,42.84 77.61,40.43 78.63,39.41 Q4.3
HS_RM_EX
  Bottom 0.254: R23.2 R22.2 90.55,40.51 X11.P$3
IL1  (via drill 0.2)
  Top 0.254: PROZ1.14 24.92,39.8 25.67,40.55 33.67,40.55 35.83,38.39 35.83,28.74 36.85,27.73 46.88,27.73 v49.93,24.68 | 59.96,9.95 60.03,9.95 R9.2 60.09,10.01 60.09,8.93 61.11,7.92 65.55,7.92 65.61,7.85 Q1.1 | 59.96,10.33 59.96,9.95 | 59.96,9.95 56.91,13 56.91,14.27 54.25,16.93 v50.44,16.93
  Bottom 0.254: v49.93,24.68 50.44,24.17 v50.44,16.93
IL2  (via drill 0.2)
  Top 0.254: PROZ1.12 25.18,39.3 25.93,40.05 33.42,40.05 35.32,38.14 35.32,28.49 36.59,27.22 46.25,27.22 v49.29,24.17 | v49.8,17.82 50.06,17.57 54.25,17.57 57.17,14.65 60.97,14.65 62.05,13.56 | R13.2 62.05,13.56 | 62.05,13.56 62.38,13.88 64.28,13.88 64.92,13.25 64.92,11.98 65.42,11.47 65.7,11.47 Q2.1 | Q2.1 66.25,11.16 | 66.2,11.34 Q2.1
  Bottom 0.254: v49.29,24.17 49.8,23.66 v49.8,17.82
ILK1  (via drill 0.2)
  Top 0.254: X18.8 6.31,4.04 6.75,3.6 6.75,3.34 SJ1.2 v7.13,1.56 | v63.65,8.8 63.65,8.85 63.52,8.97 v63.65,8.8 | v63.65,8.8 Q1.3 67.45,8.8 68.34,9.69 68.34,15.03 69.87,16.55 71.77,16.55 JP4.2
  Bottom 0.254: JP4.2 71.77,19.09 70,19.09 69.11,18.2 65.68,18.2 65.42,18.46 65.42,22.11 IC4.11 | v63.65,8.8 63.65,4.11 62.38,2.83 62.38,1.69 61.23,0.55 8.15,0.55 v7.13,1.56
ILK1_CH  (via drill 0.2)
  Top 0.254: X18.7 7.56,5.2 8.65,4.11 SJ1.1 8.65,0.93 9.04,0.55 64.79,0.55 v65.17,0.93 | X20.P$3 65.2,16.39 v66.19,15.41
  Bottom 0.254: v66.19,15.41 66.19,6.01 65.17,4.99 v65.17,0.93
ILK2  (via drill 0.2)
  Top 0.254: v63.26,11.09 63.26,11.94 63.43,12.11 Q2.3 | JP3.2 62.55,17.82 X20.P$2
  Bottom 0.254: IC4.12 IC4.13 63.01,17.44 61.97,16.39 X20.P$2 61.11,16.37 61.11,11.6 61.61,11.09 v63.26,11.09
INTERLOCK_OK  (via drill 0.2)
  Top 0.254: 76.21,41.45 IC7.1 76.31,41.19 v74.31,41.19 | IC7.7 81.31,49.33 81.04,49.06 74.69,49.06 v74.31,48.68 | IC6.1 76.16,28.11 v74.44,28.11 | IC6.7 81.31,36 80.92,35.6 v74.44,35.6 | PROZ1.44 52.4,34.14 53.36,33.19 53.61,33.19 56.41,30.39 56.41,26.08 56.72,25.76 | LED5.A 55.52,24.55 56.72,25.76 | 56.72,25.76 57.04,25.44 60.22,25.44 60.98,24.68 60.98,22.65 61.23,22.39 65.93,22.39 v66.82,23.28 67.71,24.17 v71.27,24.17
  Bottom 0.254: v74.31,48.68 v74.31,41.19 74.31,39.79 74.44,39.66 v74.44,35.6 v74.44,28.11 74.44,24.43 74.19,24.17 v71.27,24.17 | v66.82,23.28 IC4.10
JTCK  (via drill 0.2)
  Top 0.254: PROZ1.18 23.5,40.8 v23.77,41.06
  Bottom 0.254: v23.77,41.06 22.5,39.79 8.78,39.79 8.15,40.43 8.15,43.73 7.38,44.49 X2.5
JTDI  (via drill 0.2)
  Top 0.254: PROZ1.16 24.15,40.3 v24.4,40.55
  Bottom 0.254: X2.6 4.97,43.22 7,43.22 7.64,42.59 7.64,40.17 8.53,39.28 23.13,39.28 v24.4,40.55
JTDO  (via drill 0.2)
  Top 0.254: PROZ1.20 21.97,41.3 v22.24,41.57
  Bottom 0.254: X2.7 8.02,47.03 9.16,45.89 9.16,41.06 9.42,40.81 21.48,40.81 v22.24,41.57
JTMS
  Top 0.254: PROZ1.59 46.68,43.8 43.33,47.16 27.2,47.16 26.18,48.17 11.58,48.17 9.92,46.52 9.92,42.46 9.42,41.95 X2.3
JTNRST  (via drill 0.2)
  Top 0.254: PROZ1.22 21.58,41.8 21.99,42.2 22.5,42.2 v23.13,41.57
  Bottom 0.254: X2.8 5.1,45.63 7.64,45.63 8.65,44.62 8.65,40.68 9.04,40.3 21.86,40.3 v23.13,41.57
LEM_1  (via drill 0.2)
  Top 0.254: PROZ1.15 9.35,40.3 C18.1 v4.34,34.46
  Bottom 0.254: C18.1 v4.34,34.46 R26.2 2.01,32.04 D7.P$2
LEM_2  (via drill 0.2)
  Top 0.254: v6.24,34.46 6.24,36.49 9.55,39.8 PROZ1.13 | D6.P$2 5.35,32.13 5.35,32.55 v6.24,32.55
  Bottom 0.254: C17.1 v6.24,34.46 v6.24,32.55 R25.2
LEM_3  (via drill 0.2)
  Top 0.254: PROZ1.11 9.81,39.3 8.15,37.63 v8.15,34.46 | 8.53,32.43 v8.15,32.43 R24.2 8.19,32 D8.P$2
  Bottom 0.254: C16.1 v8.15,34.46 R24.2 v8.15,32.43
LK_1  (via drill 0.2)
  Top 0.254: PROZ1.23 11.23,42.3 10.94,42.59 10.94,46.01 12.08,47.16 25.67,47.16 26.69,46.14 35.58,46.14 36.34,45.38 36.34,29 37.1,28.23 47.52,28.23 v50.56,25.19 | v51.07,15.03 53.74,15.03 54.12,14.65 54.12,13.38 v56.41,11.09
  Bottom 0.254: v50.56,25.19 51.07,24.68 v51.07,15.03 | v56.41,11.09 IC13.9
LK_2  (via drill 0.2)
  Top 0.254: PROZ1.21 11.09,41.8 10.43,42.46 10.43,46.27 11.83,47.67 25.93,47.67 26.94,46.65 35.83,46.65 36.85,45.63 36.85,29.25 37.36,28.74 48.15,28.74 v51.2,25.7
  Bottom 0.254: v51.2,25.7 51.71,25.19 51.71,14.14 51.07,13.5 51.07,11.47 51.45,11.09 IC13.6
LK_EF  (via drill 0.2)
  Top 0.254: PROZ1.8 25.83,38.3 26.56,39.03 32.91,39.03 34.31,37.63 34.31,27.98 36.09,26.2 45.1,26.2 v48.53,22.77 | v49.42,16.17 49.8,16.17 49.93,16.3 53.99,16.3 54.76,15.54 54.76,14.01 v56.41,12.36
  Bottom 0.254: v49.42,16.17 48.53,17.06 v48.53,22.77 | R46.1 57.96,13.66 IC13.8 v56.41,12.36
LK_ON  (via drill 0.2)
  Top 0.254: PROZ1.10 25.44,38.8 26.18,39.54 33.16,39.54 34.82,37.89 34.82,28.23 36.34,26.71 45.61,26.71 v48.66,23.66 | v50.44,15.66 v52.98,15.66
  Bottom 0.254: v48.66,23.66 49.17,23.16 49.17,17.31 50.44,16.04 v50.44,15.66 | 51.83,12.49 51.96,12.36 IC13.7 52.98,12.36 v52.98,15.66
LK_RM  (via drill 0.2)
  Top 0.254: PROZ1.58 46.42,43.3 45.1,44.62 41.8,44.62 v41.17,43.98
  Bottom 0.254: v41.17,43.98 41.04,43.98 | Q5.3 40.57,43.39 v41.17,43.98 | R31.1 41.29,44.11 v41.17,43.98
MISO  (via drill 0.2)
  Top 0.254: IC7.11 v77.31,49.95 | IC6.11 v77.31,38.01 76.68,38.65 64.84,38.65 X5.P$6 | IC15.11 v77.31,24.43
  Bottom 0.254: X5.P$6 60.33,36.82 R48.2 | v77.31,24.43 77.31,28.7 77.61,29 77.61,34.33 77.31,34.63 v77.31,38.01 77.31,40.09 76.98,40.43 76.98,49.62 v77.31,49.95
MISO_S  (via drill 0.2)
  Top 0.254: PROZ1.42 53.33,38.3 53.74,37.89 56.53,37.89 | 56.53,37.89 57.42,37.89 v57.93,37.38 | D12.P$2 56.53,37.89
  Bottom 0.254: v57.93,37.38 57.8,37.45 R48.1
MOSI  (via drill 0.2)
  Top 0.254: X5.P$5 72.7,39.32 73.42,40.05 74.06,40.05 74.31,39.79 v76.73,39.79 77.11,39.79 77.31,40 IC7.2 | IC6.2 77.31,28.92 v76.98,29.25 | IC15.2 77.31,15.2 v76.98,15.54
  Bottom 0.254: X5.P$5 60.31,39.32 R49.2 | v76.73,39.79 76.73,34.58 76.98,34.33 v76.98,29.25 76.73,29 76.73,24.04 76.98,23.79 v76.98,15.54
MOSI_S  (via drill 0.2)
  Top 0.254: PROZ1.41 53.46,38.8 53.87,38.39 57.55,38.39 v57.93,38.78
  Bottom 0.254: v57.93,38.78 57.93,38.84 R49.1 59.07,39.98 D13.P$2
N$1
  Top 0.254: LED1.C R1.2
N$2
  Top 0.254: LED2.C R2.2
N$3
  Bottom 0.254: R7.1 40.79,15.98 C5.1 40.91,15.79 40.79,15.66 40.79,14.33 R8.1
N$4  (via drill 0.2)
  Top 0.254: IC8.5 20.14,12.68 20.08,12.61 v20.08,12.36 R58.1 | X13.3 19.19,19.99 v19.2,19.98
  Bottom 0.254: 20.08,11.92 C13.1 20.53,12.36 v20.08,12.36 19.58,12.36 19.2,12.74 v19.2,19.98
N$5
  Bottom 0.254: X10.P$3 90.55,31.5 X9.P$4
N$6  (via drill 0.2)
  Top 0.254: IC7.3 v78.31,40.68 | R60.1 84.85,51.35 86.89,49.32 86.89,43.93 X11.P$1
  other vias: 78.31,41.95 78.31,41.32
  pour Bottom (no thermals): 78.17,40.43 79.39,40.43 80.92,41.95 86.12,41.95 86.12,43.47 80.16,43.47 78.89,42.2 78.17,42.2
N$7  (via drill 0.2)
  Top 0.254: v5.86,21.25 X15.2
  Bottom 0.254: R26.1 4.34,22.77 v5.86,21.25
N$9  (via drill 0.2)
  Top 0.254: IC9.5 12.91,12.8 12.85,12.74 v12.85,12.36 14.24,12.36 R57.1 | X14.3 12.45,19.99 v12.46,19.98
  Bottom 0.254: 12.85,11.92 C14.1 | 13.29,12.49 C14.1 | v12.46,19.98 12.46,15.92 11.96,15.41 11.96,12.61 12.21,12.36 v12.85,12.36 13.29,12.36 C14.1
N$10  (via drill 0.2)
  Top 0.254: IC6.9 v79.31,37.25 | R61.1 87.01,51.35 89.05,49.32 89.05,38.47 X10.P$1
  other vias: 79.31,36.62 79.31,37.89
  pour Bottom (no thermals): 79.01,38.27 80.41,38.27 82.95,35.73 86.25,35.73 86.25,34.2 82.44,34.2 80.28,36.36 79.01,36.36
N$11
  Bottom 0.254: X12.P$3 90.55,45.09 X11.P$4
N$12  (via drill 0.2)
  Top 0.254: IC6.3 v78.31,27.6 | R62.1 88.66,50.46 89.55,49.57 89.55,33.01 X9.P$1
  other vias: 78.31,28.24 78.31,26.97
  pour Bottom (no thermals): 78.12,26.71 79.52,26.71 81.04,28.23 86.25,28.23 86.25,29.76 79.39,29.76 78.12,28.49
N$13  (via drill 0.2)
  Top 0.254: v79.31,50.97 IC7.9 | R59.1 83.08,51.03 X12.P$1
  other vias: 79.31,50.33 79.31,51.6
  pour Bottom (no thermals): 79.01,51.98 80.66,51.98 83.2,49.44 86.25,49.44 86.25,47.79 82.57,47.79 80.54,49.95 79.01,49.95
N$14
  Bottom 0.254: R10.1 73.04,22.33 JP4.1
N$15
  Bottom 0.254: C2.1 29.42,36.55 29.36,36.49 29.36,32.43 | IC2.3 30.83,32.43 29.36,32.43 | 29.36,32.43 29.36,29.76 28.85,29.25 28.85,27.47 24.28,22.9 21.23,22.9 J3.P$2
N$16
  Bottom 0.254: R36.1 18.52,51.73 Q6.1
N$17
  Bottom 0.254: R4.2 23.96,34.9 24.02,34.84 IC2.8
N$18
  Bottom 0.254: 47.07,13.12 R6.1 47.96,13.62 C4.1 47.96,15.92 R5.1
N$19
  Bottom 0.254: R7.2 40.85,19.28 41.04,19.09 42.44,19.09 J1.P$2
N$20
  Bottom 0.254: IC1.8 36.09,34.84 35.32,35.6 35.32,36.8 R3.2
N$21
  Bottom 0.254: J2.P$2 47.07,18.58 R5.2
N$24
  Bottom 0.254: R15.1 71.33,14.33 JP3.1
N$25  (via drill 0.2)
  Top 0.254: v68.34,54.27 68.34,53.38 68.35,53.39 X16.3
  Bottom 0.254: R30.1 68.22,54.4 v68.34,54.27
N$26
  Bottom 0.254: R16.2 69.61,19.6 JP3.3
N$27
  Bottom 0.254: JP4.3 75.14,15.28 R11.2
N$28  (via drill 0.2)
  Top 0.254: v55.52,21.5 LED5.C
  Bottom 0.254: R17.2 v55.52,21.5
N$29  (via drill 0.2)
  Top 0.254: v59.58,21.5 LED4.C
  Bottom 0.254: R14.2 v59.58,21.5
N$30  (via drill 0.2)
  Top 0.254: v57.68,21.5 LED3.C
  Bottom 0.254: R12.2 v57.68,21.5
N$31  (via drill 0.2)
  Top 0.254: v10.05,21.25 X14.2
  Bottom 0.254: R25.1 6.24,25.06 v10.05,21.25
N$32  (via drill 0.2)
  Top 0.254: IC10.5 6.17,12.93 6.11,12.87 v6.11,12.61 7.38,12.61 R56.1 | v5.86,19.98 X15.3
  Bottom 0.254: 6.11,12.04 C15.1 | v5.86,19.98 5.86,16.17 5.22,15.54 5.22,13.12 5.73,12.61 v6.11,12.61 6.56,12.61 C15.1 | 6.43,12.74 C15.1
N$33  (via drill 0.2)
  Top 0.254: v14.37,21.25 X13.2
  Bottom 0.254: R24.1 8.15,26.33 10.94,23.54 13.35,23.54 14.37,22.52 v14.37,21.25
N$34
  Bottom 0.254: R40.1 16.91,7.41 17.29,7.03 17.29,6.16 Q9.1
N$35  (via drill 0.2)
  Top 0.254: v71.39,54.52 71.14,54.27 71.14,53.45 X16.1 70.85,53.1
  Bottom 0.254: R28.1 71.27,54.65 v71.39,54.52
N$36
  Bottom 0.254: R19.1 88.65,26.65 Q3.1
N$37
  Bottom 0.254: R22.1 86.58,40.43 Q4.1
N$38
  Bottom 0.254: R32.1 35.75,45.59 Q5.1
N$39  (via drill 0.2)
  Top 0.254: v37.48,41.06 37.48,29.38 37.61,29.25 48.66,29.25 v52.34,25.57 | v52.34,13.76 52.72,13.76 56.15,10.33 56.15,7.2 X17.P$3
  Bottom 0.254: v37.48,41.06 36.98,41.57 35.83,41.57 R33.2 R32.2 | v52.34,25.57 v52.34,13.76
N$40  (via drill 0.2)
  Top 0.254: v14.24,1.31 14.24,1.68 IC12.P$3
  Bottom 0.254: R45.1 13.99,3.34 14.24,3.09 v14.24,1.31
N$41
  Bottom 0.254: IC13.13 56.66,6.01 56.41,5.76 56.41,4.45 X17.P$2
N$42
  Bottom 0.254: IC13.2 54.37,6.01 54.88,5.5 54.88,3.47 X17.P$1
N$43
  Top 0.254: R41.1 12.21,1.56 IC12.P$1
N$44
  Bottom 0.254: R39.1 11.19,10.22 11.19,9.31 10.69,8.8 10.69,5.88 11.01,5.56 Q8.1
N$45
  Top 0.254: R37.1 0.91,30.12 Q7.1
N$46
  Top 0.254: LED6.C R59.2
N$47
  Top 0.254: LED7.C R60.2
N$48
  Top 0.254: LED8.C R61.2
N$49
  Top 0.254: LED9.C R62.2
N$50  (via drill 0.2)
  Top 0.254: IC12.P$6 12.33,3.6 12.46,3.47 15.39,3.47 15.89,3.98 R44.1
  Bottom 0.254: R44.1 16.02,3.85 R45.2
  other vias: 16.02,3.98
N$51  (via drill 0.2)
  Top 0.254: v84.22,23.66 83.97,23.41 83.97,14.65 86.63,11.98 86.63,8.17 JP1.2 | v82.19,23.66 81.34,23.66 IC15.7
  Bottom 0.254: v84.22,23.66 v82.19,23.66
N$53
  Top 0.254: IC15.1 76.31,11.12 78.38,9.06 80.28,9.06 82.44,6.9 JP2.2
N$54
  Top 0.254: LED10.C R63.2
N$59  (via drill 0.2)
  Top 0.254: X22.P$1 89.36,11.6 93.11,11.6 R72.1
  other vias: 78.31,14.04 78.31,14.68 78.31,13.41
  pour Bottom (no thermals): 78.12,14.9 78.12,13.25 84.85,13.25 86.25,14.65 86.25,16.04 84.22,16.04 83.08,14.9
N$60  (via drill 0.2)
  Top 0.254: X21.P$1 86.95,19.98 91.2,19.98 91.84,19.34 91.84,12.87 R71.1 | v79.31,23.66 IC15.9
  other vias: 79.31,23.03 79.31,24.3
  pour Bottom (no thermals): 79.01,24.55 80.41,24.55 82.82,22.14 86.25,22.14 86.25,20.62 82.31,20.62 80.16,22.77 79.01,22.77
N$61
  Top 0.254: LED12.C R71.2
N$62
  Top 0.254: LED13.C R72.2
N$63
  Bottom 0.254: R76.1 87.34,13 Q12.1
N$64
  Bottom 0.254: R74.1 87.21,19.22 Q13.1
NALERT  (via drill 0.2)
  Top 0.254: PROZ1.35 53.46,41.8 54.63,42.97 v56.02,42.97 | v59.58,24.81 LED4.A 59.58,24.43 60.47,23.54 60.47,22.27 60.85,21.89 66.69,21.89 v68.09,23.28
  Bottom 0.254: v68.09,23.28 IC4.9 | v56.02,42.97 56.02,30.78 58.56,28.23 58.56,25.82 v59.58,24.81
NALERT1
  Bottom 0.254: X6.P$2 R50.2 68.22,47.28 65.3,44.36 65.3,34.2 64.15,33.06 62.5,33.06 61.74,32.3 IC4.1
NALERT2
  Bottom 0.254: X7.P$2 R51.2 67.96,40.3 66.31,38.65 66.31,32.81 64.92,31.41 64.92,27.22 64.66,26.96 63.26,26.96 63.01,27.22 IC4.2
NALERT3
  Bottom 0.254: X8.P$2 R52.2 68.47,32.39 68.47,30.65 68.72,30.39 68.72,26.84 69.36,26.2 IC4.8
NCS1  (via drill 0.2)
  Top 0.254: v47.64,51.86 50.69,48.81 56.02,48.81 X5.P$4
  Bottom 0.254: IC3.15 v47.64,51.86
NCS2  (via drill 0.2)
  Top 0.254: v46.75,52.49 47.9,52.49 51.07,49.32 58.01,49.32 X5.P$3
  Bottom 0.254: IC3.14 46.37,52.87 v46.75,52.49
NCS3  (via drill 0.2)
  Top 0.254: v45.48,53.13 47.9,53.13 51.2,49.82 60,49.82 X5.P$2
  Bottom 0.254: IC3.13 45.1,53.51 v45.48,53.13
NCS4  (via drill 0.2)
  Top 0.254: v43.83,55.03 47.9,55.03 51.58,51.35 71.65,51.35 72.66,52.36 79.65,52.36 80.16,51.86 80.16,51.1 IC7.8
  Bottom 0.254: IC3.12 v43.83,55.03
NCS5  (via drill 0.2)
  Top 0.254: v42.56,53.76 47.9,53.76 51.33,50.33 73.17,50.33 v73.81,50.97 | v73.81,39.41 74.06,39.16 79.65,39.16 80.31,38.49 IC6.8
  Bottom 0.254: IC3.11 v42.56,53.76 | v73.81,50.97 73.81,50.33 73.68,50.21 73.68,39.92 73.81,39.79 v73.81,39.41
NCS6  (via drill 0.2)
  Top 0.254: v41.29,54.4 47.9,54.4 51.45,50.84 72.41,50.84 v73.17,51.6 | v73.17,25.7 73.68,25.19 80.03,25.19 80.28,24.93 80.28,23.67 IC15.8
  Bottom 0.254: IC3.10 v41.29,54.4 | v73.17,51.6 v73.17,25.7
NFAULT  (via drill 0.2)
  Top 0.254: PROZ1.53 v42.94,40.8 | v57.68,24.68 LED3.A
  Bottom 0.254: v42.94,40.8 44.98,38.77 44.98,29.76 48.41,26.33 57.17,26.33 57.68,25.82 v57.68,24.68 58.31,24.04 63.9,24.04 65.68,25.82 66.82,25.82 68.09,27.09 IC4.6
NFAULT1
  Bottom 0.254: IC4.3 64.28,31.41 65.8,32.93 65.8,43.47 68.6,46.27 71.01,46.27 R53.2 72.15,47.41 X6.P$1
NFAULT2
  Bottom 0.254: X7.P$1 R54.2 71.14,39.28 68.47,39.28 66.82,37.63 66.82,32.68 65.55,31.41 IC4.4
NFAULT3
  Bottom 0.254: R55.2 X8.P$1 71.14,36.49 68.85,36.49 67.33,34.97 67.33,32.55 66.82,32.04 IC4.5
NRST
  Top 0.254: PROZ1.17 4.85,40.8 X2.4
RM_KVL1  (via drill 0.2)
  Top 0.254: PROZ1.33 53.19,42.8 54.63,44.24 v57.04,44.24 | v79.27,22.14 75.84,22.14 72.53,25.44 72.53,27.47 71.52,28.49 62.76,28.49 62.25,27.98 R73.1 61.61,26.46 v60.98,26.46
  Bottom 0.254: v57.04,44.24 57.17,44.11 57.17,30.9 59.58,28.49 59.58,27.22 60.34,26.46 v60.98,26.46 | Q13.3 84.7,18.07 80.41,18.07 79.65,18.84 79.65,21.76 v79.27,22.14
RM_KVL1_EX
  Bottom 0.254: R77.2 R74.2 90.55,19.56 X21.P$3
RM_KVL2  (via drill 0.2)
  Top 0.254: PROZ1.34 53.33,42.3 54.63,43.6 v56.53,43.6 | v77.61,21.5 75.84,21.5 71.9,25.44 71.9,27.22 71.14,27.98 64.15,27.98 63.9,27.73 R75.1
  Bottom 0.254: v56.53,43.6 56.66,43.47 56.66,30.78 59.07,28.36 59.07,26.58 59.84,25.82 R75.1 | v77.61,21.5 77.61,13 78.38,12.23 Q12.3
  other vias: 63.9,25.82
RM_KVL2_EX
  Bottom 0.254: X22.P$3 91.13,14.82 R76.2 R78.2
SCLK
  Top 0.254: IC7.5 80.31,39.38 80.79,38.9 82.06,38.9 83.33,37.63 83.33,29.12 | 83.33,29.12 83.33,13.76 81.93,12.36 80.79,12.36 80.31,12.84 IC15.5 | X5.P$7 73.31,34.32 74.06,33.57 74.06,30.52 74.69,29.89 79.52,29.89 80.16,29.25 80.16,28.49 80.28,28.36 | IC6.5 80.28,27.66 80.28,28.36 | 80.28,28.36 81.04,29.12 83.33,29.12
  Bottom 0.254: X5.P$7 60.67,34.32 R47.2
SCLK_S  (via drill 0.2)
  Top 0.254: PROZ1.60 53.19,37.8 53.61,37.38 55.26,37.38 55.64,37 55.64,36.49 55.9,36.24 57.8,36.24 58.18,35.85 v58.18,35.22
  Bottom 0.254: v58.18,35.22 58.18,34.9 R47.1 58.38,33.38 58.82,32.93 60.05,32.93 D11.P$2
SLS_CO1  (via drill 0.2)
  Top 0.254: IC6.4 79.31,26.38 79.14,26.2 75.33,26.2 71.77,29.76 59.2,29.76 v53.87,35.09 | PROZ1.57 46.03,42.8 v45.74,43.09
  Bottom 0.254: v45.74,43.09 53.36,35.47 53.48,35.47 v53.87,35.09
SLS_RM  (via drill 0.2)
  Top 0.254: v82.06,25.7 75.2,25.7 71.77,29.12 v71.14,29.12 59.2,29.12 53.87,34.46 53.36,34.46 v53.1,34.71 | PROZ1.56 45.39,42.3 v45.1,42.59
  Bottom 0.254: Q3.3 v82.06,25.7 | R18.1 v71.14,29.12 | v53.1,34.71 45.61,42.2 45.48,42.2 v45.1,42.59
SLS_RM_EX
  Bottom 0.254: R20.2 R19.2 90.55,26.92 X9.P$3
SPI_CS  (via drill 0.2)
  Top 0.254: PROZ1.38 v54.12,40.3
  Bottom 0.254: IC3.6 42.56,49.95 42.94,50.33 49.67,50.33 50.69,49.32 50.69,43.73 v54.12,40.3
TS1  (via drill 0.2)
  Top 0.254: PROZ1.40 53.6,39.3 53.87,39.03 54.74,39.03 v54.76,39.05 | v59.71,56.05 59.71,54.4 58.95,53.63 58.1,53.63 D9.P$2 57.08,53.68 v55.52,52.11
  Bottom 0.254: R30.2 68.15,56.62 C21.2 66.37,56.68 R29.1 60.34,56.68 v59.71,56.05 | v54.76,39.05 54.76,51.35 v55.52,52.11
TS2  (via drill 0.2)
  Top 0.254: PROZ1.39 53.73,39.8 53.87,39.66 v55.39,39.66 | v70,56.68 70,55.79 69.23,55.03 67.2,55.03 65.3,53.13 61.36,53.13 D10.P$2 61.36,52.75 60.72,52.11 v56.79,52.11
  Bottom 0.254: R27.1 R28.2 71.71,56.62 C20.2 v70,56.68 | v55.39,39.66 55.39,50.71 v56.79,52.11
USART_RXD  (via drill 0.2)
  Top 0.254: PROZ1.30 20.03,43.8 v20.46,44.24 | X2.10 4.97,48.3 6.75,48.3 7.38,48.94 v20.08,48.94
  Bottom 0.254: v20.08,48.94 20.46,48.55 v20.46,44.24
USART_TXD  (via drill 0.2)
  Top 0.254: PROZ1.28 20.8,43.3 v21.1,43.6 | X2.9 v21.1,49.57
  Bottom 0.254: v21.1,49.57 v21.1,43.6
VBAT  (via drill 0.2)
  Top 0.254: IC12.P$2 13.28,2.26 13.48,2.45 15.51,2.45 R44.2 v16.02,1.69 | C19.1 79.14,55.03 v79.52,55.41 | LED6.A LED7.A v86,57.58 LED8.A LED9.A | LED12.A v93.11,7.12 LED13.A | LED10.A 38.63,9.22 TERA-DC/DC1.VIN
  Route15 0.254: v78,1.69 v78,2.71 | v79.27,1.69 v79.27,2.71
  Bottom 0.254: v35.07,12.61 34.57,12.61 D2.C | R43.2 v19.83,9.82 | IC13.1 v54.12,4.74 | IC11.2 81.17,55.92 80.03,55.92 v79.52,55.41 | R42.2 14.24,8.3 v14.75,8.8 | v78,2.71 78.11,2.71 D1.C
  other vias: 35.07,11.6 34.05,11.6 34.05,12.61
  pour Route15 (no thermals): 95.02,0.54 95.02,58.04 79.52,58.04 79.52,53.54 81.02,52.04 84.02,52.04 86.02,50.04 86.02,15.04 87.02,14.04 89.02,14.04 90.52,12.54 90.52,9.04 88.52,7.04 60.02,7.04 59.02,8.04 59.02,10.04 58.02,11.04 42.02,11.04 39.77,13.29 21.27,13.29 20.52,12.54 0.02,12.54 0.52,0.54
VL_CO1  (via drill 0.2)
  Top 0.254: IC15.4 79.31,15.61 78.76,16.17 74.95,16.17 74.31,16.8 74.31,22.39 71.9,24.81 61.49,24.81 60.22,26.08 60.22,27.22 v53.61,33.82 | v45.36,41.44 45.99,41.44 46.13,41.3 PROZ1.54
  Bottom 0.254: v45.36,41.44 52.98,33.82 v53.61,33.82
VREF_PTC_CH  (via drill 0.2)
  Top 0.254: v75.2,54.78 76.28,54.78 C22.1 | 69.49,52.9 69.49,53.25 | 69.49,53.25 v69.49,54.27 | v66.95,53.51 66.95,53.32 X16.4 | X16.2 69.57,53.17 69.49,53.25
  Bottom 0.254: IC11.6 v75.2,54.78 | v66.95,53.51 66.95,54.27 66.5,54.72 C21.1 | C20.1 69.93,54.72 v69.49,54.27
  pour Route15: 65,58 65,53 66,52 77.5,52 78.5,53 78.5,58

## Text on the board
Bottom: Master / BMS Ibex / V2.0 | bottom
tTest: Master BMS Ibex | Temperatur | TERA TU Graz, Sept. 2014 / Pöschl Rene | GND | NCS1 | NCS2 | NCS3 | MISO | Hauptschütz | MOSI | CLK | 3V3 | ALERT | FAULT | FAULT | ALERT | Charger | R OFF | First | 3V3 / OK | IL | Interlock | 3V3 | CAN 2 | Last | GND | ON | Lock | Mot | RM | 12V | VSS / CANH / CANL / GND | 5V | V2
bTest: CAN / Transiver | 12V | GND